# EAGLE schematic v1_circuit_EAGLE (EAGLE 9.2.1)

## Sheet 1 of 2
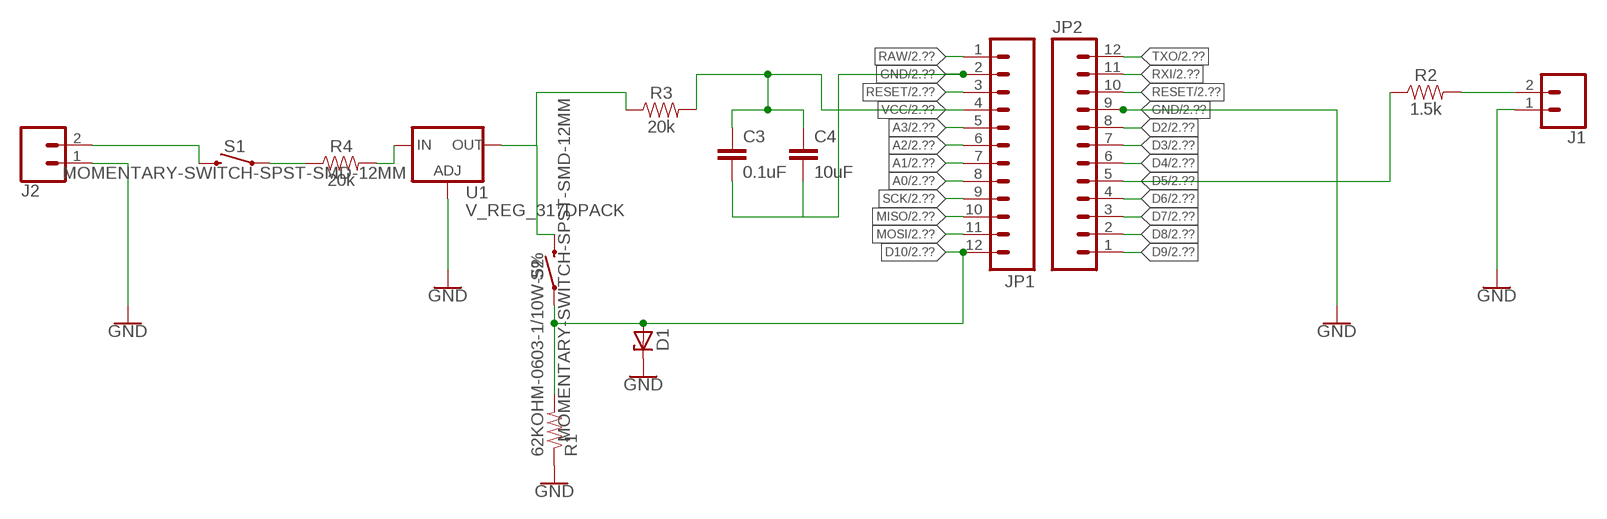
[diagram p0: schematic, sheet 1]

### Parts
C3  0.1uF  0.1UF-0603-100V-10%  [0603]
C4  10uF  10UF-0805-10V-10%  [0805]
D1  ZENER-DIODETO236  [TO236]
J1  CONN_02-JST-2MM-SMT  [JST-2-SMD]
J2  CONN_02-JST-2MM-SMT  [JST-2-SMD]
JP1  M12PTH  [1X12]
JP2  M12PTH  [1X12]
R1  62KOHM-0603-1/10W-5%  [0603]
R2  1.5k  1.5KOHM-0603-1/10W-1%  [0603]
R3  20k  20KOHM-0603-1/10W-5%  [0603]
R4  20k  20KOHM-0603-1/10W-5%  [0603]
S1  MOMENTARY-SWITCH-SPST-SMD-12MM  [TACTILE_SWITCH_SMD_12MM]
S2  MOMENTARY-SWITCH-SPST-SMD-12MM  [TACTILE_SWITCH_SMD_12MM]
U1  V_REG_317DPACK  [V-REG_DPACK]

### Nets
A0: JP1.8 ; also sheet 2
A1: JP1.7 ; also sheet 2
A2: JP1.6 ; also sheet 2
A3: JP1.5 ; also sheet 2
D2: JP2.8 ; also sheet 2
D3: JP2.7 ; also sheet 2
D4: JP2.6 ; also sheet 2
D5: JP2.5 R2.1 ; also sheet 2
D6: JP2.4 ; also sheet 2
D7: JP2.3 ; also sheet 2
D8: JP2.2 ; also sheet 2
D9: JP2.1 ; also sheet 2
D10: D1.A JP1.12 R1.2 S2.1 ; also sheet 2
GND [vcc]: C3.2 C4.2 D1.C J1.1 J2.1 JP1.2 JP2.9 R1.1 U1.1(ADJ) ; also sheet 2
MISO: JP1.10 ; also sheet 2
MOSI: JP1.11 ; also sheet 2
N$1: J2.2 S1.3
N$2: R4.1 S1.1
N$3: R4.2 U1.3(IN)
N$4: R3.1 S2.3 U1.4(OUT)
N$5: J1.2 R2.2
RAW [vcc]: JP1.1 ; also sheet 2
RESET: JP1.3 JP2.10 ; also sheet 2
RXI: JP2.11 ; also sheet 2
SCK: JP1.9 ; also sheet 2
TXO: JP2.12 ; also sheet 2
VCC: C3.1 C4.1 JP1.4 R3.2 ; also sheet 2

## Sheet 2 of 2
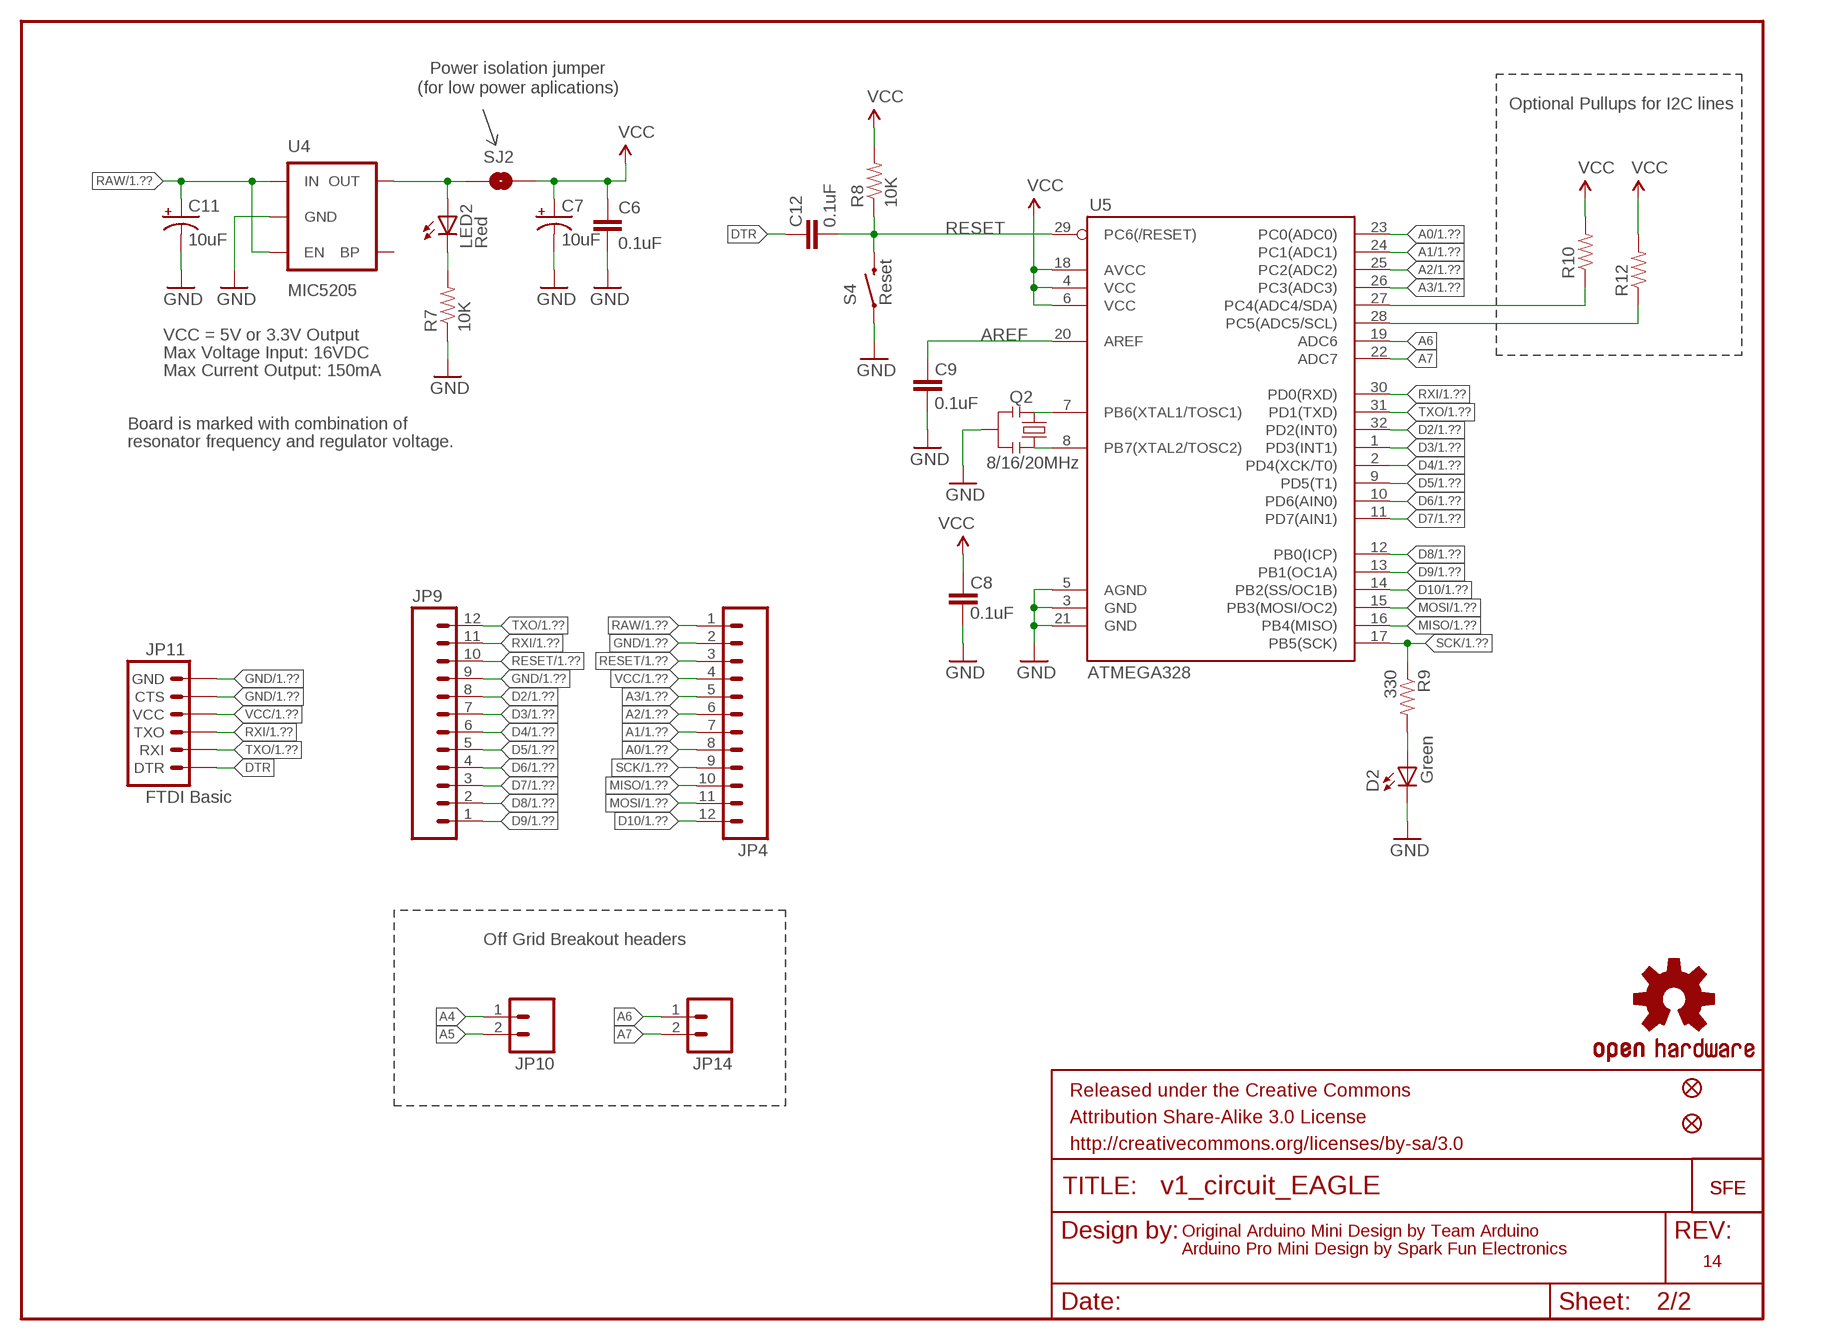
[diagram p1: schematic, sheet 2]

### Parts
C6  0.1uF  CAP0603-CAP  [0603-CAP]
C7  10uF  CAP_POL1206  [EIA3216]
C8  0.1uF  CAP0603-CAP  [0603-CAP]
C9  0.1uF  CAP0603-CAP  [0603-CAP]
C11  10uF  CAP_POL1206  [EIA3216]
C12  0.1uF  CAP0603-CAP  [0603-CAP]
D2  Green  LED  [0603-LED-ALT1]
FRAME2  FRAME-LETTER  [CREATIVE_COMMONS]
JP4  M12PTH  [1X12]
JP9  M12PTH  [1X12]
JP10  M02PTH  [1X02]
JP11  FTDI Basic  ARDUINO_SERIAL_PROGRAMPTH  [1X06]
JP12  FIDUCIALUFIDUCIAL  [MICRO-FIDUCIAL]
JP13  FIDUCIALUFIDUCIAL  [MICRO-FIDUCIAL]
JP14  M02PTH  [1X02]
LED2  Red  LED  [0603-LED-ALT1]
Q2  8/16/20MHz  RESONATOR1:1  [RESONATOR-SMD-1:1]
R7  10K  RESISTOR0603-RES  [0603-RES]
R8  10K  RESISTOR0603-RES  [0603-RES]
R9  330  RESISTOR0603-RES  [0603-RES]
R10  RESISTOR0603-RES  [0603-RES]
R12  RESISTOR0603-RES  [0603-RES]
S4  Reset  SWITCH-MOMENTARY-2SMD-ALT01  [TACTILE-SWITCH-SMD-ALT01]
SJ2  SOLDERJUMPERNC  [SJ_2S]
U4  MIC5205  V_REG_LDOSMD  [SOT23-5]
U5  ATMEGA328  ATMEGA168  [TQFP32-08]
U$2  LOGO-SFENEW  [SFE-NEW-WEBLOGO]
U$4  LOGO-SFESK  [SFE-LOGO-FLAME]
U$5  OSHW-LOGOS  [OSHW-LOGO-S]

### Nets
A0: JP4.8 U5.23(PC0(ADC0)) ; also sheet 1
A1: JP4.7 U5.24(PC1(ADC1)) ; also sheet 1
A2: JP4.6 U5.25(PC2(ADC2)) ; also sheet 1
A3: JP4.5 U5.26(PC3(ADC3)) ; also sheet 1
A4: JP10.1 R10.1 U5.27(PC4(ADC4/SDA))
A5: JP10.2 R12.1 U5.28(PC5(ADC5/SCL))
A6: JP14.1 U5.19(ADC6)
A7: JP14.2 U5.22(ADC7)
AREF: C9.2 U5.20(AREF)
D2: JP9.8 U5.32(PD2(INT0)) ; also sheet 1
D3: JP9.7 U5.1(PD3(INT1)) ; also sheet 1
D4: JP9.6 U5.2(PD4(XCK/T0)) ; also sheet 1
D5: JP9.5 U5.9(PD5(T1)) ; also sheet 1
D6: JP9.4 U5.10(PD6(AIN0)) ; also sheet 1
D7: JP9.3 U5.11(PD7(AIN1)) ; also sheet 1
D8: JP9.2 U5.12(PB0(ICP)) ; also sheet 1
D9: JP9.1 U5.13(PB1(OC1A)) ; also sheet 1
D10: JP4.12 U5.14(PB2(SS/OC1B)) ; also sheet 1
DTR: C12.2 JP11.1(DTR)
GND [vcc]: C6.2 C7.C(-) C8.1 C9.1 C11.C(-) D2.C JP4.2 JP9.9 JP11.5(CTS) JP11.6(GND) Q2.2 R7.1 S4.1 S4.2 U4.2(GND) U5.3(GND) U5.5(AGND) U5.21(GND) ; also sheet 1
MISO: JP4.10 U5.16(PB4(MISO)) ; also sheet 1
MOSI: JP4.11 U5.15(PB3(MOSI/OC2)) ; also sheet 1
N$17: D2.A R9.2
N$18: Q2.3 U5.8(PB7(XTAL2/TOSC2))
N$19: Q2.1 U5.7(PB6(XTAL1/TOSC1))
N$20: LED2.A SJ2.1 U4.5(OUT)
N$21: LED2.C R7.2
RAW [vcc]: C11.A(+) JP4.1 U4.1(IN) U4.3(EN) ; also sheet 1
RESET: C12.1 JP4.3 JP9.10 R8.1 S4.3 S4.4 U5.29(PC6(/RESET)) ; also sheet 1
RXI: JP9.11 JP11.3(TXO) U5.30(PD0(RXD)) ; also sheet 1
SCK: JP4.9 R9.1 U5.17(PB5(SCK)) ; also sheet 1
TXO: JP9.12 JP11.2(RXI) U5.31(PD1(TXD)) ; also sheet 1
VCC: C6.1 C7.A(+) C8.2 JP4.4 JP11.4(VCC) R8.2 R10.2 R12.2 SJ2.2 U5.4(VCC) U5.6(VCC) U5.18(AVCC) ; also sheet 1
Unconnected: U4.4(BP)

### Notes on the sheet
- Power isolation jumper
- (for low power aplications)
- Optional Pullups for I2C lines
- VCC = 5V or 3.3V Output
- Max Voltage Input: 16VDC
- Max Current Output: 150mA
- Board is marked with combination of
- resonator frequency and regulator voltage.
- Off Grid Breakout headers
- Original Arduino Mini Design by Team Arduino
- Arduino Pro Mini Design by Spark Fun Electronics
- 14

## Library data of the parts
C3 = SparkFun-Capacitors:0.1UF: 0.1µF ceramic capacitors A capacitor is a passive two-terminal electrical component used to store electrical energy temporarily in an electric field.; PROD_ID: CAP-08390
C4 = SparkFun-Capacitors:10UF: 10.0µF ceramic capacitors A capacitor is a passive two-terminal electrical component used to store electrical energy temporarily in an electric field.; PROD_ID: CAP-11330
C6 C8 C9 C12 = SparkFun:CAP: Capacitor Standard 0603 ceramic capacitor, and 0.1" leaded capacitor.
C7 C11 = SparkFun:CAP_POL: Capacitor Polarized These are standard SMD and PTH capacitors. Normally 10uF, 47uF, and 100uF in electrolytic and tantalum varieties. Always verify the external diameter of the through hole cap, it varies with capacity, voltage, and manufacturer. The EIA devices should be standard.
D1 = diode:ZENER-DIODE: Z-Diode
D2 LED2 = Testing:LED: LEDs Standard schematic elements and footprints for 5mm, 3mm, 1206, and 0603 sized LEDs. 5mm - Spark Fun Electronics SKU : COM-00529 (and others)
FRAME2 = SparkFun-Aesthetics:FRAME-LETTER: Schematic Frame Standard 8.5x11 US Letter frame
J1 J2 = SparkFun-Connectors:CONN_02: Multi connection point. Often used as Generic Header-pin footprint for 0.1 inch spaced/style header connections On any of the 0.1 inch spaced packages, you can populate with these: Break Away Headers - Straight <https://www.sparkfun.com/products/116> (PRT-00116) Break Away Male Headers - Right Angle <https://www.sparkfun.com/products/553> (PRT-00553) Female Headers <https://www.sparkfun.com/products/115> (PRT-00115) Break Away Headers - Machine Pin <https://www.sparkfun.com/products/117> (PRT-00117) Break Away Female Headers - Swiss Machine Pin <https://www.sparkfun.com/products/743> (PRT-00743) For SCREWTERMINALS and SPRING TERMINALS visit here: Screw Terimnals on SparkFun.com <https://www.sparkfun.com/search/results?term=Screw+Terminals> (5mm/3.5mm/2.54mm spacing) This device is also useful as a general connection point to wire up your design to another part of your project. Our various solder wires solder well into these plated through hole pads. Hook-Up Wire - Assortment (Stranded, 22 AWG) <https://www.sparkfun.com/products/11375> (PRT-11375) Hook-Up Wire - Assortment (Solid Core, 22 AWG) <https://www.sparkfun.com/products/11367> (PRT-11367) View the entire wire category on our website here <https://www.sparkfun.com/categories/141> Special notes: Molex polarized connector foot print use with: PRT-08233 with associated crimp pins and housings. 2.54_SCREWTERM for use with PRT-10571. 3.5mm Screw Terminal footprints for PRT-08084 5mm Screw Terminal footprints for use with PRT-08432; PROD_ID: CONN-11443
JP1 JP2 JP4 JP9 = SparkFun:M12: Header 12 Standard 12-pin 0.1" header. Use with straight break away headers (SKU : PRT-00116), right angle break away headers (PRT-00553), swiss pins (PRT-00743), machine pins (PRT-00117), and female headers (PRT-00115).
JP10 JP14 = SparkFun:M02: Header 2 Standard 2-pin 0.1" header. Use with straight break away headers (SKU : PRT-00116), right angle break away headers (PRT-00553), swiss pins (PRT-00743), machine pins (PRT-00117), and female headers (PRT-00115). Molex polarized connector foot print use with SKU : PRT-08233 with associated crimp pins and housings.
JP11 = SparkFun:ARDUINO_SERIAL_PROGRAM
JP12 JP13 = SparkFun:FIDUCIAL: Fiducial Alignment Points Various fiducial points for machine vision alignment.
Q2 = Testing:RESONATOR: Resonator Small SMD resonator. This is the itty bitty 10/20MHz resonators with built in caps. CSTCE10M0G55 and CSTCE20M0V53. Footprint for SMD has been used in SFE production for years, and does work okay. 1:1 is an attempt to get larger fillets on the sides so it will be easier to inspect these solders in our AOI machine. The pads have been minimized to match the actual metal under the resonator. To see this relation, it includes an image import of the bottom side of the component. Imported to scale on layer 200.
R1 = SparkFun-Resistors:62KOHM: 62kΩ resistor A resistor is a passive two-terminal electrical component that implements electrical resistance as a circuit element. Resistors act to reduce current flow, and, at the same time, act to lower voltage levels within circuits. - Wikipedia
R2 = SparkFun-Resistors:1.5KOHM: 1.5kΩ resistor A resistor is a passive two-terminal electrical component that implements electrical resistance as a circuit element. Resistors act to reduce current flow, and, at the same time, act to lower voltage levels within circuits. - Wikipedia; PROD_ID: RES-08306
R3 R4 = SparkFun-Resistors:20KOHM: 20kΩ resistor A resistor is a passive two-terminal electrical component that implements electrical resistance as a circuit element. Resistors act to reduce current flow, and, at the same time, act to lower voltage levels within circuits. - Wikipedia; PROD_ID: RES-09231
R7-R10 R12 = SparkFun:RESISTOR: Resistor Basic schematic elements and footprints for 0603, 1206, and PTH resistors.
S1 S2 = SparkFun-Switches:MOMENTARY-SWITCH-SPST: Momentary Switch (Pushbutton) - SPST Normally-open (NO) SPST momentary switches (buttons, pushbuttons). Variants PTH-12MM - 12mm square, through-hole Momentary Pushbutton Switch - 12mm Square <https://www.sparkfun.com/products/9190> (COM-09190) PTH-6.0MM, PTH-6.0MM-KIT - 6.0mm square, through-hole Mini Pushbutton Switch <https://www.sparkfun.com/products/97> (COM-00097) KIT package intended for soldering kit's - only one side of pads' copper is exposed. PTH-RIGHT-ANGLE-KIT - Right-angle, through-hole Right Angle Tactile Button <https://www.sparkfun.com/products/10791> - Used on SparkFun BigTime Watch Kit <https://www.sparkfun.com/products/11734> SMD-12MM - 12mm square, surface-mount Tactile Button - SMD (12mm) <https://www.sparkfun.com/products/12993> (COM-12993) Used on SparkFun PicoBoard <https://www.sparkfun.com/products/11888> SMD-4.5MM - 4.5mm Square Trackball Switch Used on SparkFun Blackberry Trackballer Breakout <https://www.sparkfun.com/products/13169> SMD-4.6MMX2.8MM - 4.60mm x 2.80mm, surface mount Used on SparkFun SAMD21 Mini Breakout <https://www.sparkfun.com/products/13664> SMD-5.2MM, SMD-5.2-REDUNDANT - 5.2mm square, surface-mount Mini Pushbutton Switch - SMD <https://www.sparkfun.com/products/8720> (COM-08720) Used on Arduino Pro Mini <https://www.sparkfun.com/products/11114> REDUNDANT package connects both switch circuits together SMD-6.0X3.5MM - 6.0 x 3.5mm, surface mount Momentary Reset Switch SMD <https://www.sparkfun.com/products/8229> (COM-08229) SMD-6.2MM-TALL - 6.2mm square, surface mount Tactile Button - SMD (6mm) <https://www.sparkfun.com/products/12992> Used on SparkFun Digital Sandbox <https://www.sparkfun.com/products/12651> SMD-RIGHT-ANGLE - Right-angle, surface mount Used on SparkFun Block for Intel® Edison - Arduino <https://www.sparkfun.com/products/13036>; PROD_ID: SWCH-11967; SF_SKU: COM-12993
S4 = Testing:SWITCH-MOMENTARY-2: Various NO switches- pushbuttons, reed, etc
SJ2 = SparkFun-Passives:SOLDERJUMPER: Solder Jumper Standard SMD solder jumper. Used to automate production. Two varients : Normally Open and Normally Closed are the same, but have different paste layers. NC will have a large amount of paste and should jumper during reflow.
U1 = SparkFun-IC-Power:V_REG_317: Voltage Regulator Standard LM317 adjustable voltage regulator. AOI (Adjust Output Input). Google 'LM317 Calculator' for easy to use app to get the two resistor values needed. 240/720 for 5V output. 240/390 for 3.3V output. Spark Fun Electronics SKU : COM-00527; PROD_ID: IC-09888
U4 = SparkFun:V_REG_LDO: Voltage Regulator LDO Standard 150mA LDO voltage regulator in SOT-23 layout. Micrel part MIC5205. BP (by-pass) pin is used to lower output noise with 470pF cap.
U5 = SparkFun:ATMEGA168
U$2 U$4 = SparkFun:LOGO-SFE: Spark Fun Electronics PCB Logo This is the standard Spark Fun Electronics PCB logo.
U$5 = SparkFun:OSHW-LOGO: Open Source Hardware Logo This logo indicates the piece of hardware it is found on incorporates a OSHW license and/or adheres to the definition of open source hardware found here: http://freedomdefined.org/OSHW

## Net classes
0 default: width 0.203 mm
1 vcc: width 0.254 mm